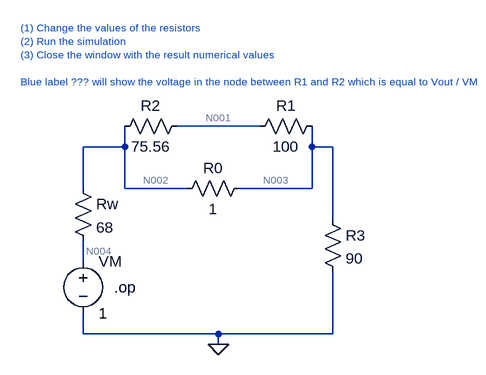
[diagram p0: schematic Wheatstone_Calculator_VM_Vout.asc]
Wheatstone_Calculator_VM_Vout.asc, the LTspice schematic file:
Version 4
SHEET 1 880 700
WIRE -720 -400 -848 -400
WIRE -928 -368 -928 -400
WIRE -928 -368 -992 -368
WIRE -640 -368 -640 -400
WIRE -608 -368 -640 -368
WIRE -992 -304 -992 -368
WIRE -928 -304 -928 -368
WIRE -832 -304 -928 -304
WIRE -640 -304 -640 -368
WIRE -640 -304 -752 -304
WIRE -608 -256 -608 -368
WIRE -992 -192 -992 -224
WIRE -992 -80 -992 -112
WIRE -784 -80 -992 -80
WIRE -608 -80 -608 -176
WIRE -608 -80 -784 -80
WIRE -784 -64 -784 -80
FLAG -784 -64 0
DATAFLAG -800 -400 ""
SYMBOL voltage -992 -208 R0
WINDOW 123 0 0 Left 0
WINDOW 39 24 124 Left 2
SYMATTR InstName VM
SYMATTR Value 1
SYMBOL res -1008 -320 R0
SYMATTR InstName Rw
SYMATTR Value 68
SYMBOL res -832 -416 R90
WINDOW 0 0 56 VBottom 2
WINDOW 3 32 56 VTop 2
SYMATTR InstName R2
SYMATTR Value 75.56
SYMBOL res -624 -416 R90
WINDOW 0 0 56 VBottom 2
WINDOW 3 32 56 VTop 2
SYMATTR InstName R1
SYMATTR Value 100
SYMBOL res -736 -320 R90
WINDOW 0 0 56 VBottom 2
WINDOW 3 32 56 VTop 2
SYMATTR InstName R0
SYMATTR Value 1
SYMBOL res -624 -272 R0
SYMATTR InstName R3
SYMATTR Value 90
TEXT -944 -152 Left 2 !.op
TEXT -1088 -552 Left 1 ;(1) Change the values of the resistors\n(2) Run the simulation\n(3) Close the window with the result numerical values\n \nBlue label ??? will show the voltage in the node between R1 and R2 which is equal to Vout / VM

The netlist it stands for:
* Wheatstone_Calculator_VM_Vout.asc
VM N004 0 1
Rw N002 N004 68
R2 N001 N002 75.56
R1 N003 N001 100
R0 N003 N002 1
R3 N003 0 90
.op
* (1) Change the values of the resistors
* (2) Run the simulation
* (3) Close the window with the result numerical values
* Blue label ??? will show the voltage in the node between R1 and R2 which is equal to Vout / VM
.backanno
.end

* Results of the author's LTspice run, read from the files saved beside the schematic
* Operating Point:
*   V(n004) = 1 V
*   V(n002) = 572.3 mV
*   V(n001) = 569.6 mV
*   V(n003) = 566.1 mV
*   I(R3) = 6.29 mA
*   I(R0) = -6.254 mA
*   I(R1) = -35.62 µA
*   I(R2) = -35.62 µA
*   I(Rw) = -6.29 mA
*   I(Vm) = -6.29 mA